# EAGLE design M900X (EAGLE 6.6.0)
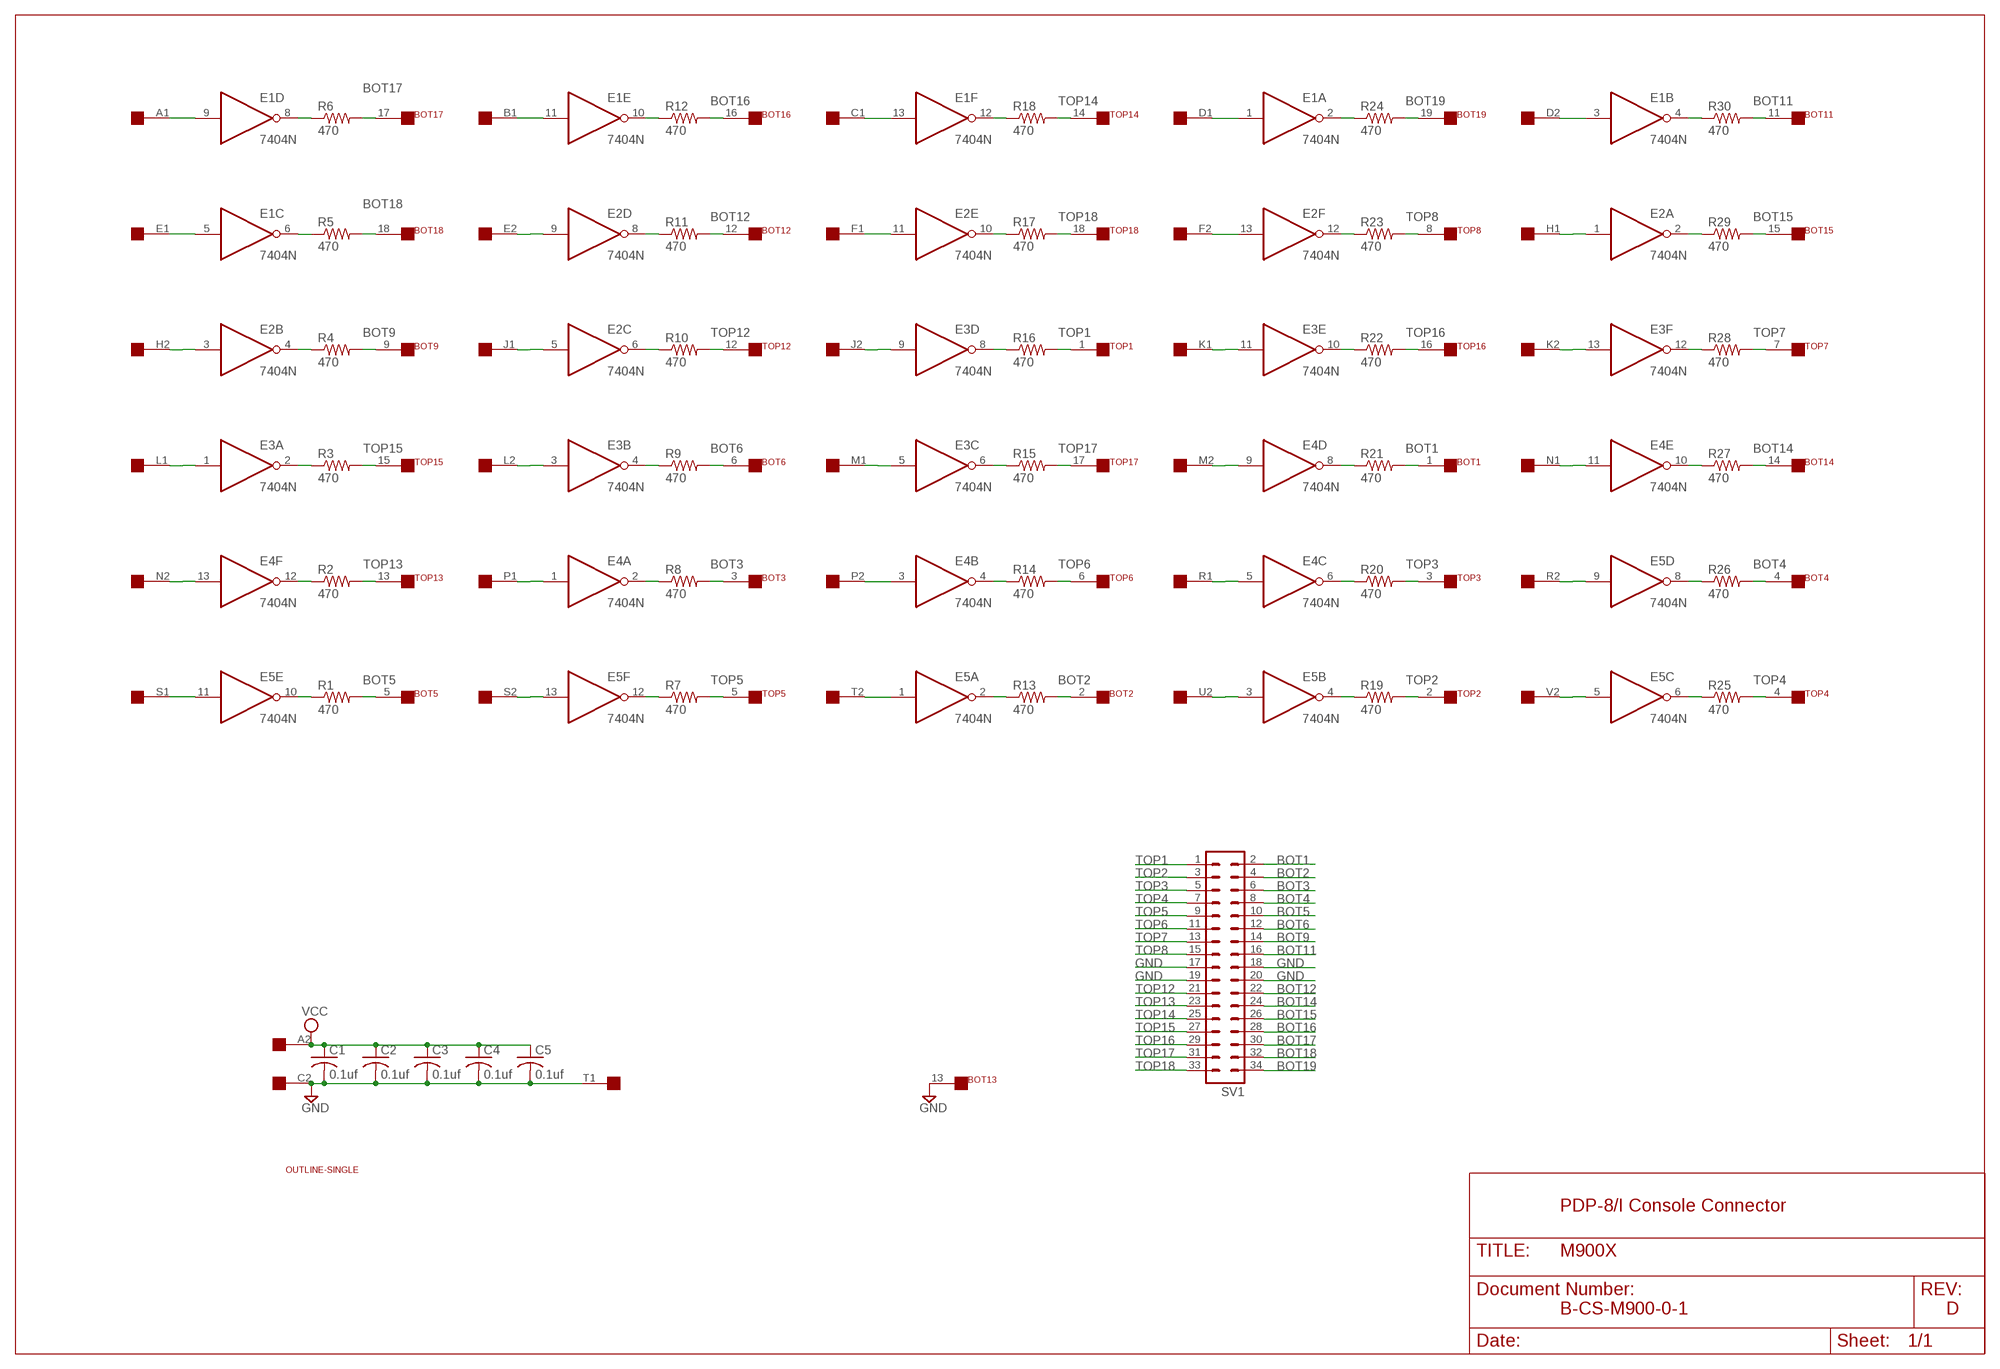
[diagram p0: schematic, sheet 1]

## Parts
BOT  FLEX19  [FLEX19]
C1  0.1uf  C-US050-025X075  [C050-025X075]
C2  0.1uf  C-US050-025X075  [C050-025X075]
C3  0.1uf  C-US050-025X075  [C050-025X075]
C4  0.1uf  C-US050-025X075  [C050-025X075]
C5  0.1uf  C-US050-025X075  [C050-025X075]
E1  7404N  [DIL14]
E2  7404N  [DIL14]
E3  7404N  [DIL14]
E4  7404N  [DIL14]
E5  7404N  [DIL14]
EDGE  SINGLE  [EDGE-CON2]
R1  470  R-US_0207/10  [0207/10]
R2  470  R-US_0207/10  [0207/10]
R3  470  R-US_0207/10  [0207/10]
R4  470  R-US_0207/10  [0207/10]
R5  470  R-US_0207/10  [0207/10]
R6  470  R-US_0207/10  [0207/10]
R7  470  R-US_0207/10  [0207/10]
R8  470  R-US_0207/10  [0207/10]
R9  470  R-US_0207/10  [0207/10]
R10  470  R-US_0207/10  [0207/10]
R11  470  R-US_0207/10  [0207/10]
R12  470  R-US_0207/10  [0207/10]
R13  470  R-US_0207/10  [0207/10]
R14  470  R-US_0207/10  [0207/10]
R15  470  R-US_0207/10  [0207/10]
R16  470  R-US_0207/10  [0207/10]
R17  470  R-US_0207/10  [0207/10]
R18  470  R-US_0207/10  [0207/10]
R19  470  R-US_0207/10  [0207/10]
R20  470  R-US_0207/10  [0207/10]
R21  470  R-US_0207/10  [0207/10]
R22  470  R-US_0207/10  [0207/10]
R23  470  R-US_0207/10  [0207/10]
R24  470  R-US_0207/10  [0207/10]
R25  470  R-US_0207/10  [0207/10]
R26  470  R-US_0207/10  [0207/10]
R27  470  R-US_0207/10  [0207/10]
R28  470  R-US_0207/10  [0207/10]
R29  470  R-US_0207/10  [0207/10]
R30  470  R-US_0207/10  [0207/10]
SV1  ML34L  [ML34L]
TOP  FLEX19  [FLEX19]
U$2  OUTLINE-SINGLE  [SINGLE]

## Nets
BOT1: BOT.1 R21.2 SV1.2
BOT2: BOT.2 R13.2 SV1.4
BOT3: BOT.3 R8.2 SV1.6
BOT4: BOT.4 R26.2 SV1.8
BOT5: BOT.5 R1.2 SV1.10
BOT6: BOT.6 R9.2 SV1.12
BOT9: BOT.9 R4.2 SV1.14
BOT11: BOT.11 R30.2 SV1.16
BOT12: BOT.12 R11.2 SV1.22
BOT14: BOT.14 R27.2 SV1.24
BOT15: BOT.15 R29.2 SV1.26
BOT16: BOT.16 R12.2 SV1.28
BOT17: BOT.17 R6.2 SV1.30
BOT18: BOT.18 R5.2 SV1.32
BOT19: BOT.19 R24.2 SV1.34
GND [supply]: BOT.13 C1.2 C2.2 C3.2 C4.2 C5.2 EDGE.C2 EDGE.T1 SV1.17 SV1.18 SV1.19 SV1.20
N$1: E1.9(D:I) EDGE.A1
N$2: E1.8(D:O) R6.1
N$3: E1.6(C:O) R5.1
N$4: E2.4(B:O) R4.1
N$5: E3.2(A:O) R3.1
N$6: E4.12(F:O) R2.1
N$7: E2.3(B:I) EDGE.H2
N$8: E5.11(E:I) EDGE.S1
N$9: E4.13(F:I) EDGE.N2
N$10: E3.1(A:I) EDGE.L1
N$11: E1.5(C:I) EDGE.E1
N$12: E4.1(A:I) EDGE.P1
N$13: E1.11(E:I) EDGE.B1
N$14: E2.9(D:I) EDGE.E2
N$15: E2.5(C:I) EDGE.J1
N$16: E3.3(B:I) EDGE.L2
N$17: E5.13(F:I) EDGE.S2
N$18: E4.2(A:O) R8.1
N$19: E3.4(B:O) R9.1
N$20: E2.6(C:O) R10.1
N$21: E2.8(D:O) R11.1
N$22: E1.10(E:O) R12.1
N$23: E5.12(F:O) R7.1
N$24: E5.10(E:O) R1.1
N$25: E4.3(B:I) EDGE.P2
N$26: E1.13(F:I) EDGE.C1
N$27: E2.11(E:I) EDGE.F1
N$28: E3.9(D:I) EDGE.J2
N$29: E3.5(C:I) EDGE.M1
N$30: E5.1(A:I) EDGE.T2
N$31: E5.2(A:O) R13.1
N$32: E4.4(B:O) R14.1
N$33: E3.6(C:O) R15.1
N$34: E3.8(D:O) R16.1
N$35: E1.12(F:O) R18.1
N$36: E2.10(E:O) R17.1
N$37: E5.4(B:O) R19.1
N$38: E4.6(C:O) R20.1
N$39: E4.8(D:O) R21.1
N$40: E3.10(E:O) R22.1
N$41: E2.12(F:O) R23.1
N$42: E1.2(A:O) R24.1
N$43: E4.5(C:I) EDGE.R1
N$44: E2.13(F:I) EDGE.F2
N$45: E3.11(E:I) EDGE.K1
N$46: E4.9(D:I) EDGE.M2
N$47: E5.3(B:I) EDGE.U2
N$48: E5.9(D:I) EDGE.R2
N$49: E1.1(A:I) EDGE.D1
N$50: E1.3(B:I) EDGE.D2
N$51: E2.1(A:I) EDGE.H1
N$52: E3.13(F:I) EDGE.K2
N$53: E4.11(E:I) EDGE.N1
N$54: E5.5(C:I) EDGE.V2
N$55: E5.6(C:O) R25.1
N$56: E5.8(D:O) R26.1
N$57: E4.10(E:O) R27.1
N$58: E3.12(F:O) R28.1
N$59: E2.2(A:O) R29.1
N$60: E1.4(B:O) R30.1
TOP1: R16.2 SV1.1 TOP.1
TOP2: R19.2 SV1.3 TOP.2
TOP3: R20.2 SV1.5 TOP.3
TOP4: R25.2 SV1.7 TOP.4
TOP5: R7.2 SV1.9 TOP.5
TOP6: R14.2 SV1.11 TOP.6
TOP7: R28.2 SV1.13 TOP.7
TOP8: R23.2 SV1.15 TOP.8
TOP12: R10.2 SV1.21 TOP.12
TOP13: R2.2 SV1.23 TOP.13
TOP14: R18.2 SV1.25 TOP.14
TOP15: R3.2 SV1.27 TOP.15
TOP16: R22.2 SV1.29 TOP.16
TOP17: R15.2 SV1.31 TOP.17
TOP18: R17.2 SV1.33 TOP.18
VCC [supply]: C1.1 C2.1 C3.1 C4.1 C5.1 EDGE.A2
Unconnected: BOT.7 BOT.8 BOT.10 EDGE.B2 EDGE.U1 EDGE.V1 TOP.9 TOP.10 TOP.11 TOP.19

## Notes on the sheet
- PDP-8/I Console Connector
- B-CS-M900-0-1 | D

## Power pins joined to a net without a drawn wire
GND: E1.7(P:GND) E2.7(P:GND) E3.7(P:GND) E4.7(P:GND) E5.7(P:GND)
VCC: E1.14(P:VCC) E2.14(P:VCC) E3.14(P:VCC) E4.14(P:VCC) E5.14(P:VCC)

## Library data of the parts
BOT TOP = dec-con:FLEX19: 19 pin Flexprint Connection
C1-C5 = rcl:C-US: CAPACITOR, American symbol
E1-E5 = 74xx-us:74*04: Hex INVERTER
EDGE = dec-con:SINGLE: Single-Height DEC board
R1-R30 = rcl:R-US_: RESISTOR, American symbol
SV1 = con-harting-ml:ML34: HARTING; OC_FARNELL: unknown; OC_NEWARK: unknown
U$2 = dec-con:OUTLINE-*: Board outlines for DEC boards.

## Net classes
0 default: width 0.381 mm
1 supply: width 0.762 mm

## Board
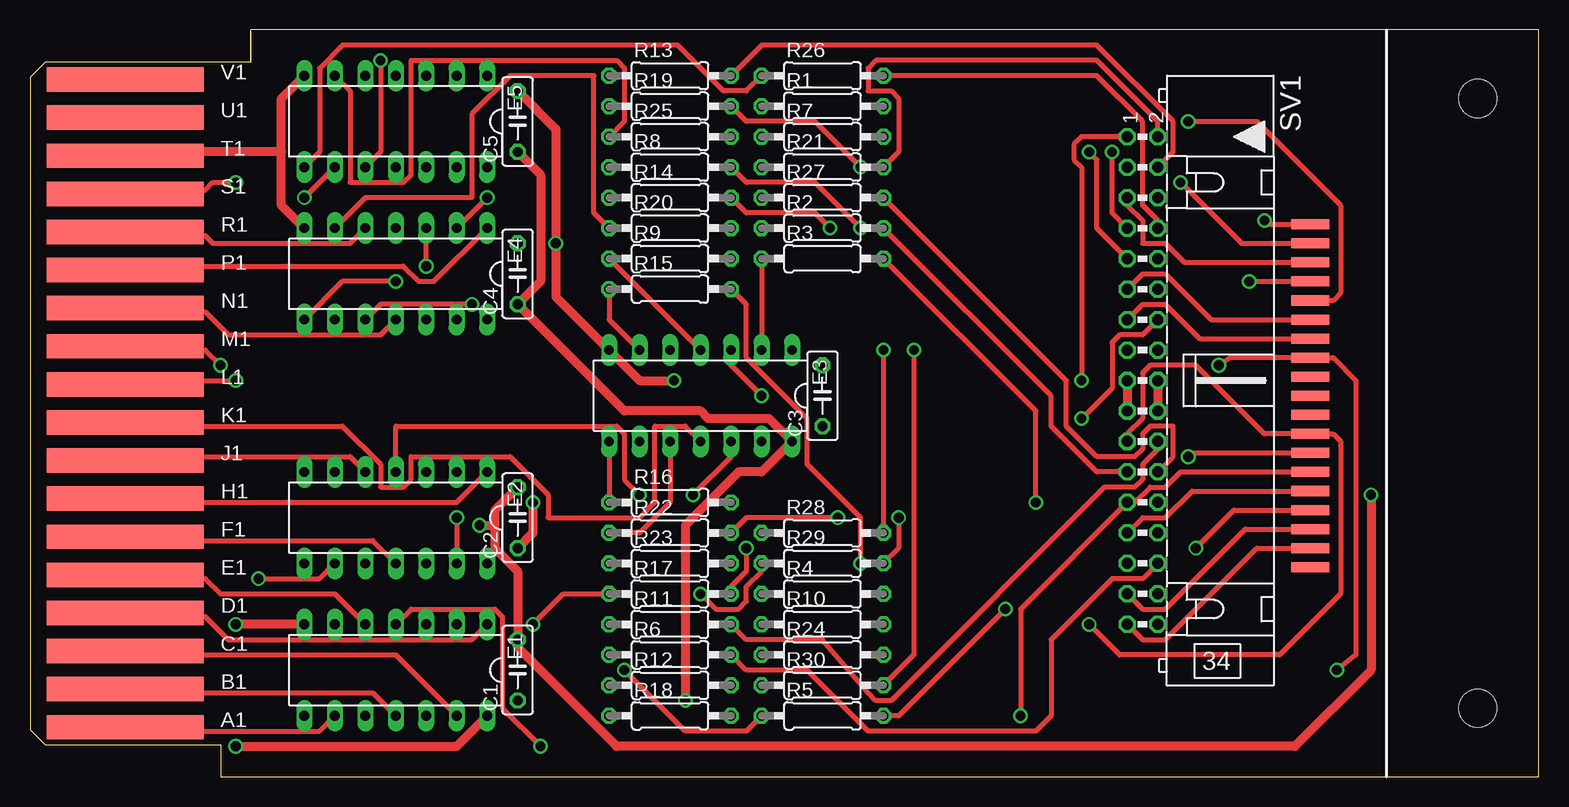
[diagram p1: board, top side]
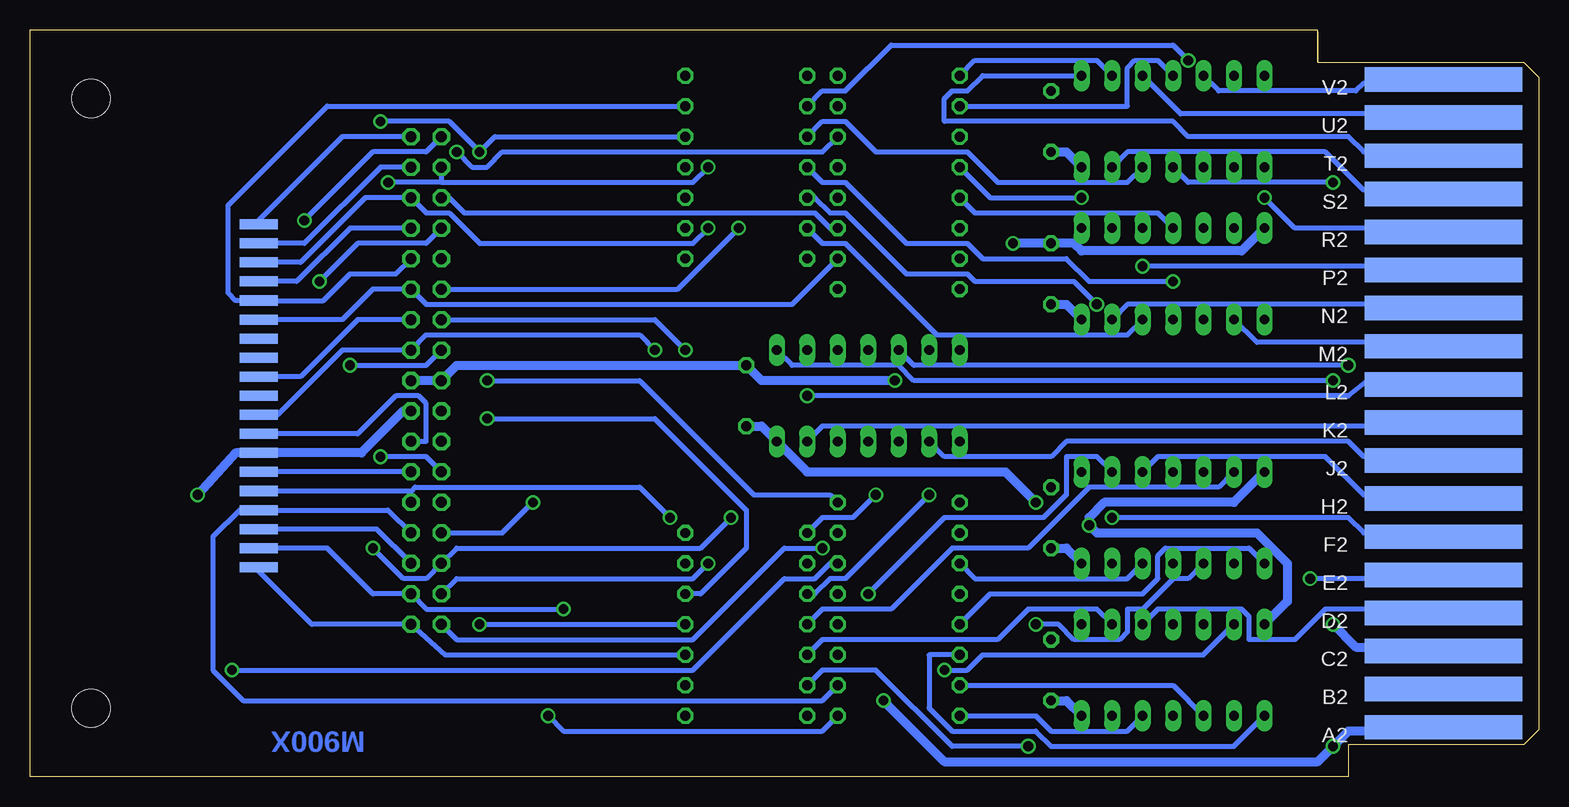
[diagram p2: board, bottom side, seen from below]

Size 125.73 x 62.23 mm. Coordinates in mm from the lower left corner, seen from the top.
Copper layers (1+16): Top 0.035mm / dielectric 1.5mm / Bottom 0.035mm
Design rules "16mils": minimum track width 16mil, minimum drill 32mil, track to track 15mil, track to pad 10mil, pad to pad 10mil, via to via 10mil, smd to smd 10mil, copper to edge 13mil, drill to drill 10mil, minimum pad ring 10mil, minimum via ring 8mil, stop-mask expansion 0mil, vias tented up to drill 0mil, thermal gap 10mil

### Footprints (pad centres in the part's own frame; a part is rotated, then mirrored left to right if it is on the bottom)
FLEX19 = smd 3.175 x 0.838: 1 0,14.287; 2 0,12.7; 3 0,11.113; 4 0,9.525; 5 0,7.938; 6 0,6.35; 7 0,4.763; 8 0,3.175; 9 0,1.587; 10 0,0; 11 0,-1.587; 12 0,-3.175; 13 0,-4.763; 14 0,-6.35; 15 0,-7.938; 16 0,-9.525; 17 0,-11.113; 18 0,-12.7; 19 0,-14.287
C050-025X075 = drill 0.813 octagon: 1 -2.54,0; 2 2.54,0
DIL14 = drill 0.813 long: 1 -7.62,-3.81; 2 -5.08,-3.81; 3 -2.54,-3.81; 4 0,-3.81; 5 2.54,-3.81; 6 5.08,-3.81; 7 7.62,-3.81; 8 7.62,3.81; 9 5.08,3.81; 10 2.54,3.81; 11 0,3.81; 12 -2.54,3.81; 13 -5.08,3.81; 14 -7.62,3.81
EDGE-CON2 = smd 13.106 x 2.032: A1 7.938,4.128; B1 7.938,7.303; C1 7.938,10.477; D1 7.938,13.652; E1 7.938,16.828; F1 7.938,20.003; H1 7.938,23.177; J1 7.938,26.352; K1 7.938,29.527; L1 7.938,32.703; M1 7.938,35.877; N1 7.938,39.053; P1 7.938,42.227; R1 7.938,45.403; S1 7.938,48.578; T1 7.938,51.752; U1 7.938,54.928; V1 7.938,58.102 | smd 13.106 x 2.032 bottom: A2 7.938,4.128; B2 7.938,7.303; C2 7.938,10.477; D2 7.938,13.652; E2 7.938,16.828; F2 7.938,20.003; H2 7.938,23.177; J2 7.938,26.352; K2 7.938,29.527; L2 7.938,32.703; M2 7.938,35.877; N2 7.938,39.053; P2 7.938,42.227; R2 7.938,45.403; S2 7.938,48.578; T2 7.938,51.752; U2 7.938,54.928; V2 7.938,58.102
0207/10 = drill 0.813 octagon: 1 -5.08,0; 2 5.08,0
ML34L = drill 0.914 octagon: 1 -20.32,-1.27; 2 -20.32,1.27; 3 -17.78,-1.27; 4 -17.78,1.27; 5 -15.24,-1.27; 6 -15.24,1.27; 7 -12.7,-1.27; 8 -12.7,1.27; 9 -10.16,-1.27; 10 -10.16,1.27; 11 -7.62,-1.27; 12 -7.62,1.27; 13 -5.08,-1.27; 14 -5.08,1.27; 15 -2.54,-1.27; 16 -2.54,1.27; 17 0,-1.27; 18 0,1.27; 19 2.54,-1.27; 20 2.54,1.27; 21 5.08,-1.27; 22 5.08,1.27; 23 7.62,-1.27; 24 7.62,1.27; 25 10.16,-1.27; 26 10.16,1.27; 27 12.7,-1.27; 28 12.7,1.27; 29 15.24,-1.27; 30 15.24,1.27; 31 17.78,-1.27; 32 17.78,1.27; 33 20.32,-1.27; 34 20.32,1.27
SINGLE = hole 3.175: 120.65,56.515; 120.65,5.715

### Placement (x,y rotation side)
BOT  106.68,31.75 0 bottom
C1  40.64,8.89 90 top
C2  40.64,21.59 90 top
C3  66.04,31.75 90 top
C4  40.64,41.91 90 top
C5  40.64,54.61 90 top
E1  30.48,8.89 180 top
E2  30.48,21.59 180 top
E3  55.88,31.75 180 top
E4  30.48,41.91 180 top
E5  30.48,54.61 180 top
EDGE  0,0 0 top
R1  66.04,55.88 0 top
R2  66.04,45.72 0 top
R3  66.04,43.18 0 top
R4  66.04,15.24 0 top
R5  66.04,5.08 0 top
R6  53.34,10.16 0 top
R7  66.04,53.34 0 top
R8  53.34,50.8 0 top
R9  53.34,43.18 0 top
R10  66.04,12.7 0 top
R11  53.34,12.7 0 top
R12  53.34,7.62 0 top
R13  53.34,58.42 0 top
R14  53.34,48.26 0 top
R15  53.34,40.64 0 top
R16  53.34,22.86 0 top
R17  53.34,15.24 0 top
R18  53.34,5.08 0 top
R19  53.34,55.88 0 top
R20  53.34,45.72 0 top
R21  66.04,50.8 0 top
R22  53.34,20.32 0 top
R23  53.34,17.78 0 top
R24  66.04,10.16 0 top
R25  53.34,53.34 0 top
R26  66.04,58.42 0 top
R27  66.04,48.26 0 top
R28  66.04,20.32 0 top
R29  66.04,17.78 0 top
R30  66.04,7.62 0 top
SV1  92.71,33.02 270 top
TOP  106.68,31.75 0 top
U$2  0,0 0 top

### Tracks (layer width: path | path; a pad name or v marks a point on that pad's centre or on a via)
BOT1
  Top 0.406: R21.2 72.39,52.07 72.39,56.52 71.76,57.15 69.85,57.15 69.85,59.05 70.49,59.69 88.9,59.69 93.98,54.61 SV1.2
  Bottom 0.406: SV1.2 99.7,53.34 106.68,46.35 BOT.1
BOT2
  Top 0.406: R13.2 60.96,60.96 88.9,60.96 95.25,54.61 95.25,52.07 SV1.4
  Bottom 0.406: BOT.2 102.87,44.45 96.52,50.8 SV1.4
BOT3  (via drill 0.81)
  Top 0.406: R8.2 59.69,49.53 65.41,49.53 v69.22,45.72
  Bottom 0.406: v69.22,45.72 70.49,44.45 88.27,44.45 90.81,46.99 92.71,46.99 SV1.6 97.79,48.26 103.19,42.86 BOT.3
BOT4
  Top 0.406: R26.2 88.9,58.42 92.71,54.61 92.71,47.62 93.98,46.35 SV1.8
  Bottom 0.406: BOT.4 103.51,41.27 99.06,45.72 SV1.8
BOT5
  Bottom 0.406: R1.2 100.97,55.88 109.22,47.62 109.22,40.32 108.59,39.69 BOT.5 101.28,39.69 99.06,41.91 95.25,41.91 SV1.10
BOT6
  Bottom 0.406: R9.2 62.23,39.37 92.71,39.37 SV1.12 97.16,40.64 99.7,38.1 BOT.6
BOT9  (via drill 0.81)
  Top 0.406: v87.63,29.84 90.17,32.38 90.17,36.2 90.81,36.83 92.71,36.83 SV1.14
  Bottom 0.406: R4.2 69.85,15.24 66.04,19.05 66.04,22.23 73.66,29.84 v87.63,29.84 | BOT.9 103.19,33.34 98.43,38.1 SV1.14
BOT11  (via drill 0.81)
  Top 0.406: R30.2 73.66,10.16 v73.66,35.56
  Bottom 0.406: v73.66,35.56 74.93,36.83 92.71,36.83 SV1.16 99.7,35.56 105.09,30.16 BOT.11
BOT12
  Top 0.406: R11.2 59.69,11.43 66.04,11.43 69.85,6.99 70.49,6.35 71.76,6.35 89.54,24.13 92.08,24.13 92.71,24.77 92.71,26.04 93.98,27.3 SV1.22
  Bottom 0.406: BOT.12 98.43,28.57 95.25,31.75 93.35,31.75 92.71,31.11 92.71,27.94 SV1.22
BOT14
  Top 0.406: R27.2 86.36,33.02 86.36,29.21 88.9,26.67 92.08,26.67 92.71,27.3 92.71,28.57 93.35,29.21 95.25,29.21 95.25,26.67 SV1.24
  Bottom 0.406: SV1.24 BOT.14
BOT15  (via drill 0.81)
  Top 0.406: R29.2 72.39,19.05 v72.39,21.59
  Bottom 0.406: v72.39,21.59 74.93,24.13 93.66,24.13 93.98,23.81 | SV1.26 93.98,23.81 | 93.98,23.81 BOT.15
BOT16
  Bottom 0.406: R12.2 59.69,6.35 107.95,6.35 110.49,8.89 110.49,20 108.27,22.23 BOT.16 95.89,22.23 SV1.28
BOT17
  Top 0.406: R6.2 59.69,8.89 64.77,8.89 69.85,3.81 83.82,3.81 85.09,5.08 85.09,11.43 90.17,16.51 92.71,16.51 SV1.30
  Bottom 0.406: BOT.17 96.84,20.64 SV1.30
BOT18  (via drill 0.81)
  Top 0.406: R5.2 72.39,5.08 v81.28,13.97
  Bottom 0.406: v81.28,13.97 92.71,13.97 SV1.32 97.16,15.24 100.97,19.05 BOT.18
BOT19
  Bottom 0.406: R24.2 91.12,10.16 SV1.34 102.24,12.7 106.68,17.14 BOT.19
GND  (via drill 0.81)
  Top 0.762: 38.74,20.95 38.74,22.23 C2.2 | 38.74,20.95 38.74,19.05 40.64,17.14 C1.2 40.64,10.79 48.9,2.54 105.41,2.54 111.76,8.89 v111.76,23.5 | v37.47,20.95 38.74,20.95 | E1.7 v17.15,12.7 | SV1.18 SV1.20 | SV1.17 SV1.19 | C5.2 43.82,53.98 v43.82,44.45 43.82,40.01 E3.7 50.8,33.02 v53.66,33.02 | E5.7 20.96,56.52 20.96,52.07 | 20.96,52.07 20.96,47.62 E4.7 | 20.96,52.07 8.26,52.07 EDGE.T1
  Bottom 0.762: E1.7 20.96,14.61 20.96,17.78 23.5,20.32 36.83,20.32 v37.47,20.95 37.47,21.59 36.2,22.86 25.4,22.86 E2.7 | v17.15,12.7 15.24,10.79 8.26,10.79 EDGE.C2 | SV1.20 94.62,30.48 98.11,26.99 BOT.13 108.59,26.99 v111.76,23.5 | SV1.18 SV1.17 90.17,34.29 C3.2 64.77,33.02 v53.66,33.02 | E4.7 24.77,43.81 38.1,43.81 38.74,44.45 C4.2 v43.82,44.45
N$1
  Top 0.406: E1.9 24.13,3.81 8.26,3.81 EDGE.A1
N$2
  Bottom 0.406: E1.8 25.4,2.54 40.64,2.54 41.91,3.81 48.9,3.81 50.8,5.71 50.8,10.16 R6.1
N$3  (via drill 0.81)
  Top 0.406: v49.53,8.89 54.61,3.81 59.69,3.81 R5.1
  Bottom 0.406: E1.6 27.94,10.16 46.36,10.16 47.63,8.89 v49.53,8.89
N$4  (via drill 0.81)
  Top 0.406: v50.8,23.5 49.53,24.77 49.53,28.57 48.9,29.21 30.48,29.21 E2.4
  Bottom 0.406: R4.1 60.33,15.24 59.06,16.51 57.79,16.51 v50.8,23.5
N$5
  Top 0.406: R3.1 E3.2
N$6
  Bottom 0.406: E4.12 34.29,36.83 50.17,36.83 57.79,44.45 59.69,44.45 R2.1
N$7
  Bottom 0.406: E2.3 31.75,26.67 17.78,26.67 14.61,23.5 8.26,23.5 EDGE.H2
N$8  (via drill 0.81)
  Top 0.406: v17.15,49.53 15.24,49.53 14.61,48.9 8.26,48.9 EDGE.S1
  Bottom 0.406: E5.11 29.21,49.53 v17.15,49.53
N$9
  Bottom 0.406: E4.13 34.29,39.37 8.26,39.37 EDGE.N2
N$10  (via drill 0.81)
  Top 0.406: v17.15,33.02 8.26,33.02 EDGE.L1
  Bottom 0.406: E3.1 62.23,34.29 53.34,34.29 52.07,33.02 v17.15,33.02
N$11
  Top 0.406: E1.5 25.4,15.24 15.88,15.24 14.61,16.51 8.26,16.51 EDGE.E1
N$12
  Top 0.406: E4.1 33.66,41.27 32.39,41.27 31.12,42.55 8.26,42.55 EDGE.P1
N$13
  Top 0.406: E1.11 28.58,6.99 8.26,6.99 EDGE.B1
N$14  (via drill 0.81)
  Top 0.406: E2.9 24.13,16.51 v19.05,16.51
  Bottom 0.406: v19.05,16.51 8.26,16.51 EDGE.E2
N$15
  Top 0.406: E2.5 26.67,26.67 8.26,26.67 EDGE.J1
N$16  (via drill 0.81)
  Top 0.406: E3.3 58.42,34.29 v60.96,31.75
  Bottom 0.406: v60.96,31.75 15.88,31.75 14.29,33.02 8.89,33.02 EDGE.L2
N$17
  Bottom 0.406: E5.13 34.29,52.07 17.78,52.07 14.61,48.9 8.26,48.9 EDGE.S2
N$18  (via drill 0.81)
  Top 0.406: v38.1,48.26 E4.2
  Bottom 0.406: v38.1,48.26 45.72,48.26 R8.1
N$19
  Top 0.406: R9.1 E3.4
N$20
  Bottom 0.406: R10.1 59.69,13.97 53.98,13.97 48.9,19.05 42.55,19.05 37.47,24.13 26.67,24.13 E2.6
N$21
  Bottom 0.406: E2.8 24.13,19.05 31.12,19.05 31.75,18.41 31.75,16.51 33.02,15.24 45.72,15.24 R11.1
N$22
  Bottom 0.406: E1.10 30.48,7.62 R12.1
N$23
  Bottom 0.406: E5.12 34.29,49.53 45.09,49.53 47.63,52.07 55.25,52.07 57.79,54.61 59.69,54.61 R7.1
N$24  (via drill 0.81)
  Top 0.406: E5.10 29.21,52.07 v29.21,59.69
  Bottom 0.406: v29.21,59.69 30.48,60.96 53.98,60.96 57.79,57.15 59.69,57.15 R1.1
N$25  (via drill 0.81)
  Top 0.406: v33.02,42.55 E4.3
  Bottom 0.406: v33.02,42.55 8.26,42.55 EDGE.P2
N$26
  Top 0.406: E1.13 30.48,10.16 8.26,10.16 EDGE.C1
N$27
  Top 0.406: E2.11 28.58,19.68 8.26,19.68 EDGE.F1
N$28
  Bottom 0.406: E3.9 49.53,26.67 40.64,26.67 39.37,27.94 15.88,27.94 14.61,26.67 8.26,26.67 EDGE.J2
N$29  (via drill 0.81)
  Top 0.406: v15.88,34.29 14.61,35.56 8.26,35.56 EDGE.M1
  Bottom 0.406: E3.5 52.07,34.29 v15.88,34.29
N$30
  Bottom 0.406: E5.1 46.36,58.42 47.63,57.15 48.9,57.15 49.53,56.52 49.53,54.61 30.48,54.61 29.21,53.34 15.88,53.34 14.61,52.07 8.26,52.07 EDGE.T2
N$31
  Bottom 0.406: E5.2 36.83,59.69 46.99,59.69 R13.1
N$32
  Bottom 0.406: E4.4 31.75,46.99 46.99,46.99 R14.1
N$33
  Top 0.406: E3.6 48.26,38.1 R15.1
N$34
  Top 0.406: E3.8 R16.1
N$35
  Bottom 0.406: E1.12 34.29,3.81 40.64,3.81 41.91,5.08 R18.1
N$36  (via drill 0.81)
  Top 0.406: R17.1 44.45,15.24 v41.91,12.7
  Bottom 0.406: v41.91,12.7 40.01,12.7 38.74,11.43 34.93,11.43 34.29,12.06 34.29,13.97 33.02,13.97 30.48,16.51 29.21,16.51 E2.10
N$37
  Bottom 0.406: E5.4 31.75,59.69 33.66,59.69 34.29,59.05 34.29,55.88 R19.1
N$38
  Top 0.406: E4.6 27.94,48.26 36.83,48.26 36.83,55.24 40.01,58.42 46.99,58.42 46.99,46.99 R20.1
N$39  (via drill 0.81)
  Top 0.406: E4.8 26.04,41.27 v30.48,41.27
  Bottom 0.406: v30.48,41.27 37.47,41.27 39.37,43.18 46.36,43.18 47.63,44.45 52.71,44.45 57.79,49.53 59.69,49.53 R21.1
N$40
  Top 0.406: R22.1 50.8,20.32 53.34,22.86 E3.10
N$41
  Bottom 0.406: E2.12 34.29,16.51 46.99,16.51 R23.1
N$42
  Bottom 0.406: R24.1 59.69,11.43 45.09,11.43 42.55,13.97 36.83,13.97 E1.2
N$43
  Top 0.406: E4.5 26.67,44.45 15.24,44.45 14.61,45.09 8.26,45.09 EDGE.R1
N$44  (via drill 0.81)
  Top 0.406: v35.56,21.59 E2.13
  Bottom 0.406: v35.56,21.59 15.88,21.59 14.61,20.32 8.26,20.32 EDGE.F2
N$45
  Top 0.406: E3.11 54.61,29.21 52.07,29.21 52.07,22.86 50.8,21.59 43.18,21.59 43.18,23.5 40.01,26.67 31.75,26.67 31.75,24.77 31.12,24.13 29.21,24.13 29.21,26.04 26.04,29.21 8.26,29.21 EDGE.K1
N$46
  Bottom 0.406: E4.9 23.5,36.2 8.26,36.2 EDGE.M2
N$47
  Bottom 0.406: E5.3 29.85,55.24 8.26,55.24 EDGE.U2
N$48  (via drill 0.81)
  Top 0.406: v22.86,48.26 E5.9
  Bottom 0.406: v22.86,48.26 20.32,45.72 8.26,45.72 EDGE.R2
N$49
  Top 0.406: E1.1 36.83,11.43 16.51,11.43 14.61,13.34 8.26,13.34 EDGE.D1
N$50
  Bottom 0.406: E1.3 31.75,13.97 24.77,13.97 24.13,13.34 24.13,11.43 20.32,11.43 17.78,13.97 8.26,13.97 EDGE.D2
N$51
  Top 0.406: E2.1 35.56,22.86 8.26,22.86 EDGE.H1
N$52
  Bottom 0.406: E3.13 59.69,29.21 8.26,29.21 EDGE.K2
N$53
  Top 0.406: E4.11 29.21,36.83 16.51,36.83 14.61,38.73 8.26,38.73 EDGE.N1
N$54
  Bottom 0.406: E5.5 26.67,57.15 15.24,57.15 14.61,57.78 8.26,57.78 EDGE.V2
N$55
  Top 0.406: R25.1 49.53,54.61 49.53,59.05 48.9,59.69 31.75,59.69 31.75,50.16 31.12,49.53 26.67,49.53 26.67,57.15 E5.6
N$56
  Top 0.406: E5.8 24.13,52.07 24.13,59.05 26.04,60.96 53.98,60.96 57.79,57.15 59.69,57.15 R26.1
N$57  (via drill 0.81)
  Top 0.406: E4.10 29.21,39.37 v36.83,39.37
  Bottom 0.406: v36.83,39.37 38.74,41.27 46.99,41.27 47.63,41.91 52.71,41.91 57.79,46.99 59.06,46.99 60.33,48.26 R27.1
N$58  (via drill 0.81)
  Top 0.406: v55.25,23.5 58.42,26.67 E3.12
  Bottom 0.406: R28.1 59.69,21.59 57.15,21.59 v55.25,23.5
N$59  (via drill 0.81)
  Top 0.406: R29.1 60.96,17.14 59.69,15.88 59.69,14.61 59.06,13.97 57.15,13.97 v55.88,15.24
  Bottom 0.406: v55.88,15.24 49.53,21.59 41.28,21.59 39.37,23.5 39.37,26.67 36.83,26.67 E2.2
N$60  (via drill 0.81)
  Top 0.406: v42.55,2.54 39.37,5.71 39.37,13.34 38.74,13.97 31.75,13.97 E1.4
  Bottom 0.406: R30.1 59.69,8.89 55.25,8.89 48.9,2.54 v42.55,2.54
TOP1  (via drill 0.81)
  Top 0.406: v87.63,33.02 87.63,50.8 87,51.44 87,52.7 87.63,53.34 SV1.1 | v102.87,46.35 103.19,46.04 TOP.1
  Bottom 0.406: R16.2 59.06,23.5 65.41,23.5 74.93,33.02 v87.63,33.02 | v102.87,46.35 97.16,52.07 92.71,52.07 SV1.1
TOP2  (via drill 0.81)
  Top 0.406: R19.2 59.69,54.61 65.41,54.61 v69.22,50.8 | TOP.2 100.97,44.45 v95.89,49.53
  Bottom 0.406: v69.22,50.8 70.49,49.53 91.44,49.53 | SV1.3 91.44,49.53 | 91.44,49.53 v95.89,49.53
TOP3
  Top 0.406: TOP.3 96.2,42.86 94.62,44.45 92.71,44.45 92.71,46.35 91.44,47.62 SV1.5
  Bottom 0.406: R20.2 59.06,45.72 60.33,46.99 89.54,46.99 90.81,48.26 SV1.5
TOP4  (via drill 0.81)
  Top 0.406: v90.17,52.07 90.17,46.99 SV1.7 | v101.6,41.27 TOP.4
  Bottom 0.406: R25.2 59.69,52.07 86.36,52.07 87.63,50.8 88.9,50.8 v90.17,52.07 | v101.6,41.27 98.43,44.45 92.71,44.45 SV1.7
TOP5  (via drill 0.81)
  Top 0.406: v88.27,52.07 88.9,51.44 88.9,45.72 SV1.9 | TOP.5 108.59,39.69 109.22,40.32 109.22,47.62 102.24,54.61 v96.52,54.61
  Bottom 0.406: R7.2 87,53.34 v88.27,52.07 90.81,54.61 v96.52,54.61
TOP6  (via drill 0.81)
  Top 0.406: R14.2 59.69,46.99 65.41,46.99 v66.68,45.72 | TOP.6 98.43,38.1 94.62,41.91 92.71,41.91 SV1.11
  Bottom 0.406: v66.68,45.72 71.76,40.64 SV1.11
TOP7  (via drill 0.81)
  Top 0.406: v71.12,35.56 R28.2 | TOP.7 97.47,36.51 94.62,39.37 92.71,39.37 SV1.13
  Bottom 0.406: v71.12,35.56 73.66,38.1 SV1.13
TOP8  (via drill 0.81)
  Top 0.406: v108.9,8.89 110.49,10.16 110.49,33.02 108.59,34.92 TOP.8 100.01,34.92 v99.06,34.29
  Bottom 0.406: R23.2 59.06,17.78 60.33,16.51 62.87,16.51 70.49,8.89 v108.9,8.89 | SV1.15 92.71,34.29 v99.06,34.29
TOP12  (via drill 0.81)
  Top 0.406: v88.27,12.7 90.81,10.16 104.14,10.16 109.22,15.24 109.22,27.62 109.22,27.94 108.59,28.57 108.27,28.57 TOP.12 102.87,28.57 97.16,34.29 93.35,34.29 92.71,33.66 92.71,29.84 91.44,28.57 SV1.21
  Bottom 0.406: v88.27,12.7 R10.2
TOP13  (via drill 0.81)
  Top 0.406: R2.2 85.09,31.75 85.09,29.21 88.9,25.4 SV1.23 | v96.52,26.67 96.84,26.99 TOP.13
  Bottom 0.406: v96.52,26.67 92.71,26.67 SV1.23
TOP14  (via drill 0.81)
  Top 0.406: v82.55,5.08 82.55,13.97 SV1.25 92.08,22.86 93.35,24.13 94.62,24.13 95.89,25.4 TOP.14
  Bottom 0.406: R18.2 59.69,3.81 81.28,3.81 v82.55,5.08
TOP15  (via drill 0.81)
  Top 0.406: R3.2 83.82,30.48 v83.82,22.86 | TOP.15 96.84,23.81 94.62,21.59 92.71,21.59 SV1.27
  Bottom 0.406: v83.82,22.86 86.36,20.32 SV1.27
TOP16  (via drill 0.81)
  Top 0.406: R22.2 59.69,21.59 v67.31,21.59 | TOP.16 100.33,22.23 v97.16,19.05
  Bottom 0.406: v67.31,21.59 69.85,19.05 90.17,19.05 SV1.29 92.71,16.51 94.62,16.51 v97.16,19.05
TOP17  (via drill 0.81)
  Top 0.406: R15.2 59.69,39.37 59.69,34.92 64.77,29.84 64.77,26.04 69.22,21.59 v69.22,17.78 | TOP.17 101.28,20.64 94.62,13.97 92.71,13.97 SV1.31
  Bottom 0.406: v69.22,17.78 70.49,16.51 90.17,16.51 SV1.31
TOP18  (via drill 0.81)
  Top 0.406: R17.2 58.42,15.88 59.69,17.14 v59.69,19.05 | TOP.18 102.24,19.05 94.62,11.43 92.71,11.43 SV1.33
  Bottom 0.406: v59.69,19.05 62.87,19.05 70.49,11.43 90.17,11.43 SV1.33
VCC  (via drill 0.81)
  Top 0.762: E1.14 35.56,2.54 v17.15,2.54 | C5.1 42.55,50.16 42.55,41.27 C4.1 49.53,30.48 55.88,30.48 56.52,29.84 61.6,29.84 E3.14 60.96,25.4 59.06,25.4 54.61,20.95 v54.61,6.35 | C2.1 41.91,20.32 v41.91,22.86
  Bottom 0.762: E1.14 39.37,6.35 C1.1 | EDGE.A2 8.26,3.81 15.88,3.81 v17.15,2.54 18.42,1.27 49.53,1.27 v54.61,6.35 | E4.14 39.37,39.37 C4.1 | E5.14 39.37,52.07 C5.1 | E2.14 39.37,19.05 C2.1 | C3.1 64.77,29.21 E3.14 60.96,25.4 44.45,25.4 v41.91,22.86

### Text on the board
Bottom: M900X